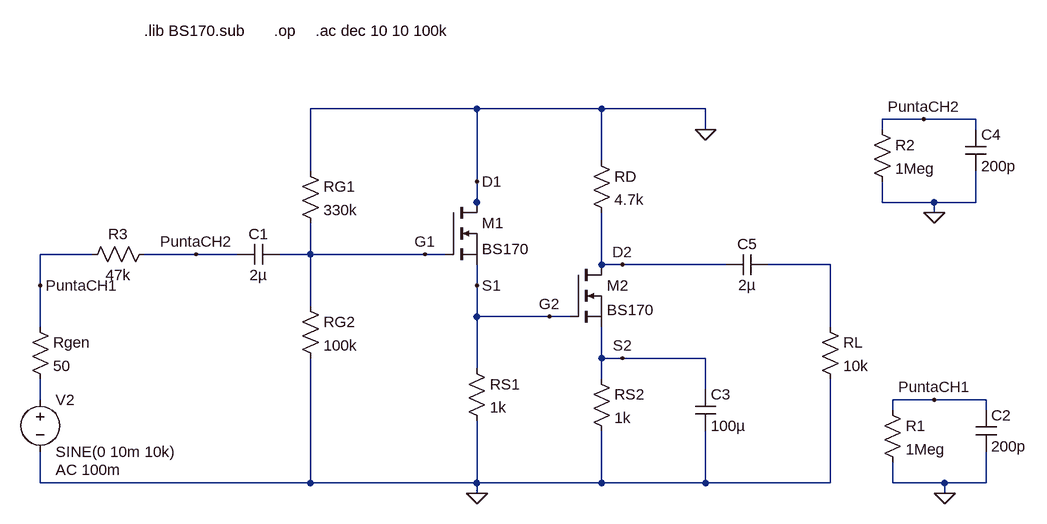
[diagram p0: schematic B_Ri.asc]
B_Ri.asc, the LTspice schematic file:
Version 4
SHEET 1 2572 856
WIRE 1008 112 752 112
WIRE 1200 112 1008 112
WIRE 1360 112 1200 112
WIRE 1696 128 1632 128
WIRE 1776 128 1696 128
WIRE 1360 144 1360 112
WIRE 1632 144 1632 128
WIRE 1776 144 1776 128
WIRE 1200 192 1200 112
WIRE 752 208 752 112
WIRE 1008 224 1008 112
WIRE 1008 256 1008 224
WIRE 1632 256 1632 224
WIRE 1712 256 1632 256
WIRE 1776 256 1776 208
WIRE 1776 256 1712 256
WIRE 1008 272 1008 256
WIRE 1712 272 1712 256
WIRE 416 336 336 336
WIRE 576 336 496 336
WIRE 640 336 576 336
WIRE 752 336 752 288
WIRE 752 336 704 336
WIRE 928 336 752 336
WIRE 960 336 928 336
WIRE 1200 352 1200 272
WIRE 1232 352 1200 352
WIRE 1392 352 1232 352
WIRE 1552 352 1456 352
WIRE 336 384 336 336
WIRE 1008 384 1008 352
WIRE 752 416 752 336
WIRE 1008 432 1008 384
WIRE 1120 432 1008 432
WIRE 1152 432 1120 432
WIRE 336 448 336 384
WIRE 1552 448 1552 352
WIRE 1200 496 1200 448
WIRE 1232 496 1200 496
WIRE 1360 496 1232 496
WIRE 1008 512 1008 432
WIRE 1200 528 1200 496
WIRE 1360 544 1360 496
WIRE 336 560 336 528
WIRE 1712 560 1648 560
WIRE 1792 560 1712 560
WIRE 1648 576 1648 560
WIRE 1792 576 1792 560
WIRE 336 688 336 640
WIRE 752 688 752 496
WIRE 752 688 336 688
WIRE 1008 688 1008 592
WIRE 1008 688 752 688
WIRE 1200 688 1200 608
WIRE 1200 688 1008 688
WIRE 1360 688 1360 608
WIRE 1360 688 1200 688
WIRE 1552 688 1552 528
WIRE 1552 688 1360 688
WIRE 1648 688 1648 656
WIRE 1728 688 1648 688
WIRE 1792 688 1792 640
WIRE 1792 688 1728 688
WIRE 1008 704 1008 688
WIRE 1728 704 1728 688
FLAG 1008 704 0
FLAG 1120 432 G2
FLAG 1232 352 D2
FLAG 1232 496 S2
FLAG 928 336 G1
FLAG 1008 224 D1
FLAG 1008 384 S1
FLAG 1728 704 0
FLAG 1712 272 0
FLAG 1360 144 0
FLAG 1712 560 PuntaCH1
FLAG 1696 128 PuntaCH2
FLAG 336 384 PuntaCH1
FLAG 576 336 PuntaCH2
SYMBOL cap 704 320 R90
WINDOW 0 0 32 VBottom 2
WINDOW 3 32 32 VTop 2
SYMATTR InstName C1
SYMATTR Value 2µ
SYMBOL res 320 432 R0
SYMATTR InstName Rgen
SYMATTR Value 50
SYMBOL voltage 336 544 R0
WINDOW 39 0 0 Left 2
WINDOW 123 24 124 Left 2
SYMATTR Value2 AC 100m
SYMATTR InstName V2
SYMATTR Value SINE(0 10m 10k)
SYMBOL nmos 960 256 R0
SYMATTR InstName M1
SYMATTR Value BS170
SYMBOL res 992 496 R0
SYMATTR InstName RS1
SYMATTR Value 1k
SYMBOL res 736 400 R0
SYMATTR InstName RG2
SYMATTR Value 100k
SYMBOL res 736 192 R0
SYMATTR InstName RG1
SYMATTR Value 330k
SYMBOL res 1184 176 R0
SYMATTR InstName RD
SYMATTR Value 4.7k
SYMBOL res 1184 512 R0
SYMATTR InstName RS2
SYMATTR Value 1k
SYMBOL cap 1344 544 R0
SYMATTR InstName C3
SYMATTR Value 100µ
SYMBOL cap 1456 336 R90
WINDOW 0 0 32 VBottom 2
WINDOW 3 32 32 VTop 2
SYMATTR InstName C5
SYMATTR Value 2µ
SYMBOL res 1536 432 R0
SYMATTR InstName RL
SYMATTR Value 10k
SYMBOL nmos 1152 352 R0
WINDOW 3 56 70 Left 2
SYMATTR Value BS170
SYMATTR InstName M2
SYMBOL res 1632 560 R0
SYMATTR InstName R1
SYMATTR Value 1Meg
SYMBOL cap 1776 576 R0
SYMATTR InstName C2
SYMATTR Value 200p
SYMBOL res 1616 128 R0
SYMATTR InstName R2
SYMATTR Value 1Meg
SYMBOL cap 1760 144 R0
SYMATTR InstName C4
SYMATTR Value 200p
SYMBOL res 512 320 R90
WINDOW 0 0 56 VBottom 2
WINDOW 3 32 56 VTop 2
SYMATTR InstName R3
SYMATTR Value 47k
TEXT 496 -8 Left 2 !.lib BS170.sub
TEXT 760 -8 Left 2 !.ac dec 10 10 100k
TEXT 696 -8 Left 2 !.op

The netlist it stands for:
* B_Ri.asc
C1 G1 PuntaCH2 2µ
Rgen PuntaCH1 N002 50
V2 N002 0 SINE(0 10m 10k) AC 100m
M1 0 G1 S1 S1 BS170
RS1 S1 0 1k
RG2 G1 0 100k
RG1 0 G1 330k
RD 0 D2 4.7k
RS2 S2 0 1k
C3 S2 0 100µ
C5 N001 D2 2µ
RL N001 0 10k
M2 D2 S1 S2 S2 BS170
R1 PuntaCH1 0 1Meg
C2 PuntaCH1 0 200p
R2 PuntaCH2 0 1Meg
C4 PuntaCH2 0 200p
R3 PuntaCH2 PuntaCH1 47k
.model NMOS NMOS
.model PMOS PMOS
.lib standard.mos
.lib BS170.sub
.ac dec 10 10 100k
.op
.backanno
.end